# EAGLE schematic AtoVproject 16n V1.1 (EAGLE 9.3.2)

## Sheet 1 of 2: Faders / Jacks / Digital
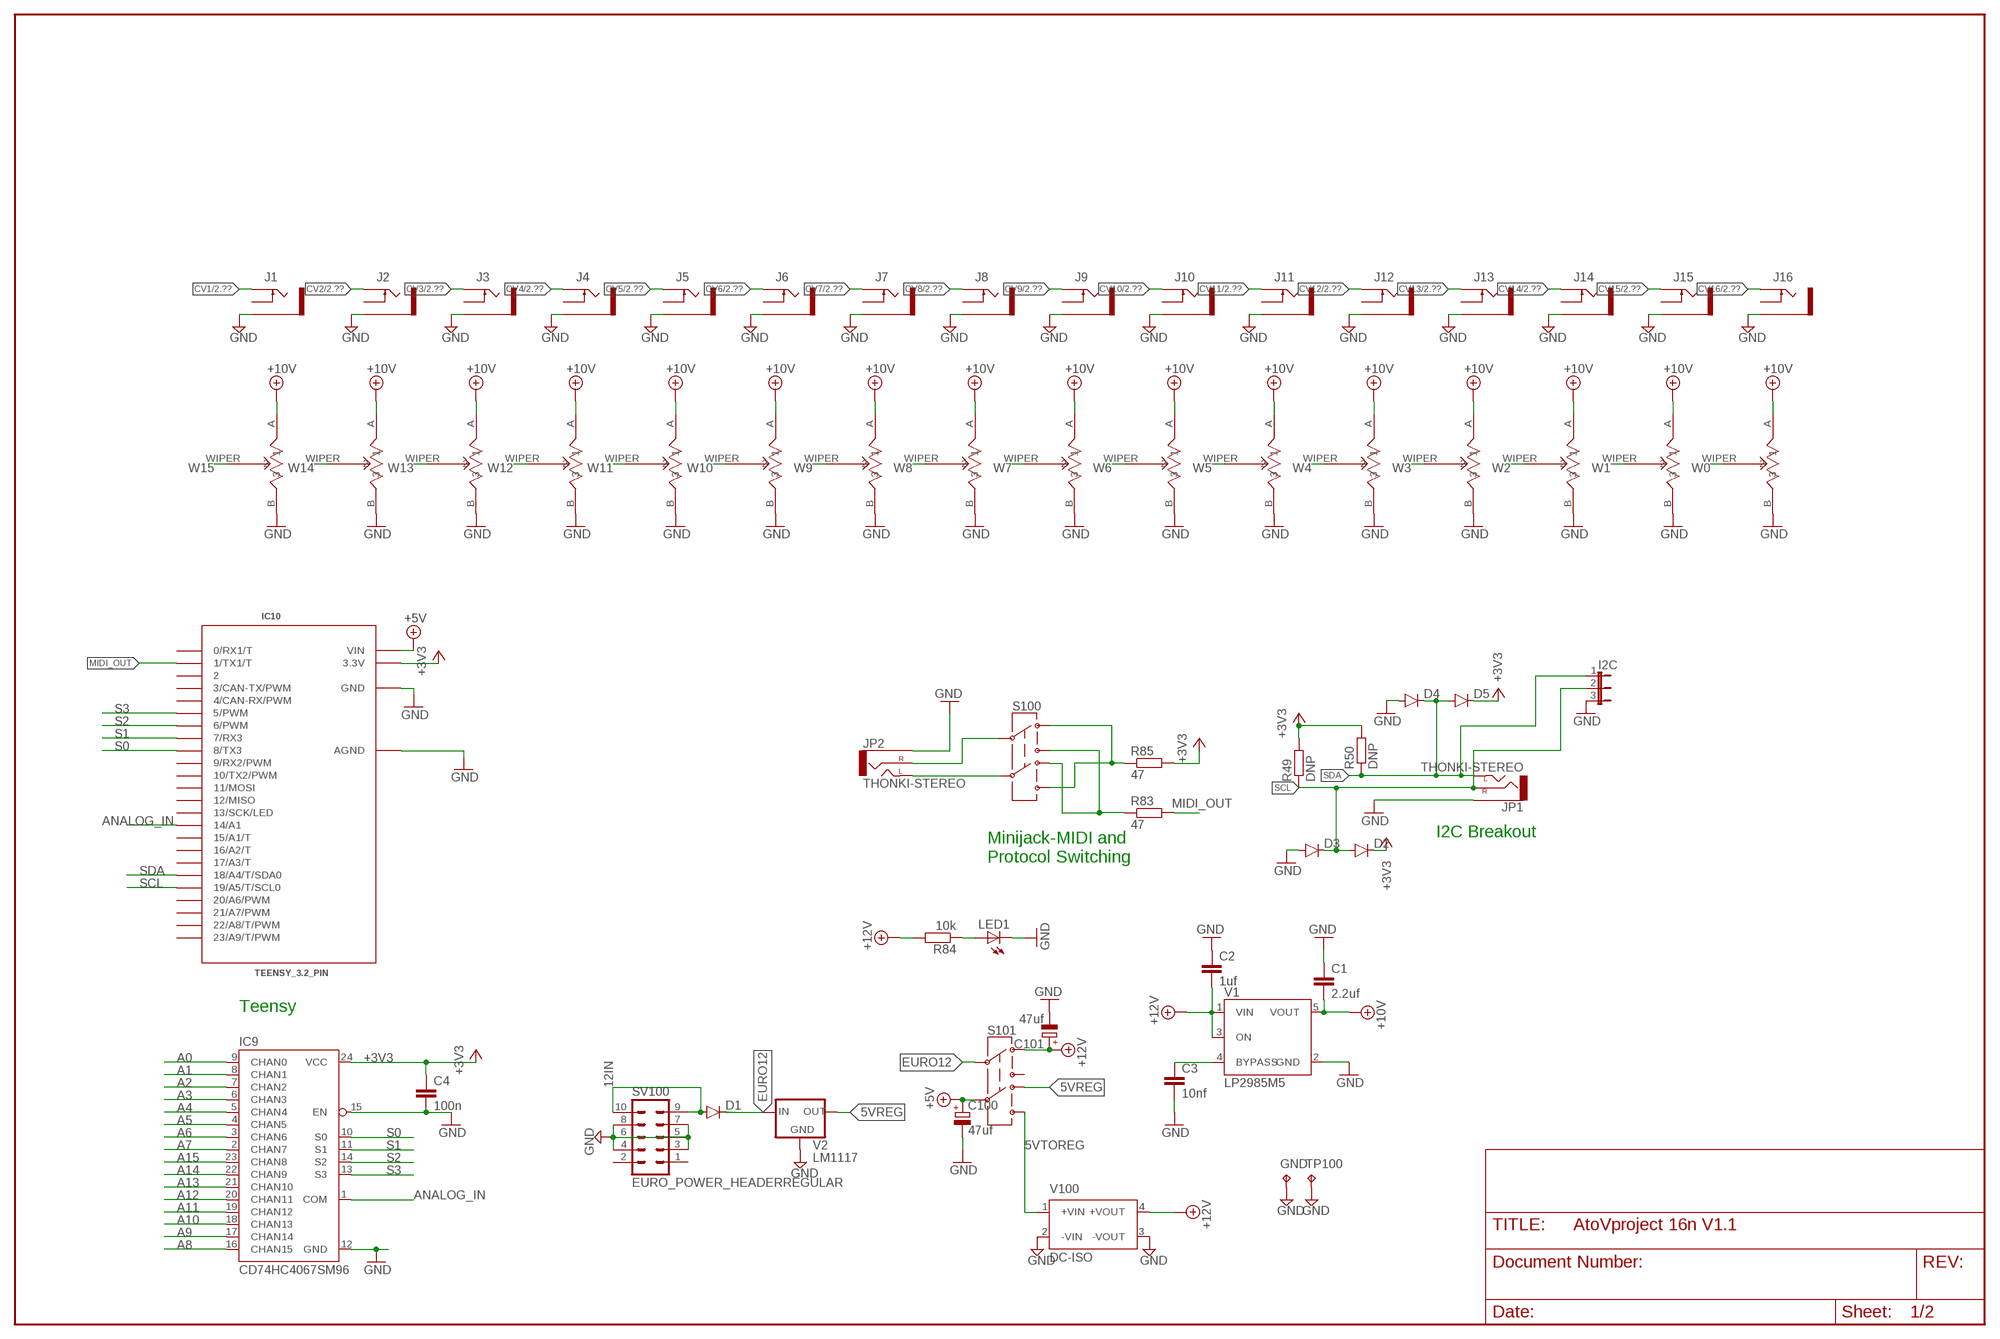
[diagram p0: schematic, sheet 1]

### Parts
C1  2.2uf  C-EUC0805  [C0805]
C2  1uf  C-EUC0805  [C0805]
C3  10nf  C-EUC0805  [C0805]
C4  100n  C-EUC0805  [C0805]
C100  47uf  CPOL-EUE2.5-6  [E2,5-6]
C101  47uf  CPOL-EUE2.5-6  [E2,5-6]
D1  DIODE-SOD123  [SOD123]
D2  DIODESOD123  [SOD-123]
D3  DIODESOD123  [SOD-123]
D4  DIODESOD123  [SOD-123]
D5  DIODESOD123  [SOD-123]
GND  TPPAD1-17  [P1-17]
I2C  JP2E  [JP2]
IC9  CD74HC4067SM96  744067SO24  [SOIC127P1030X265-24]
IC10  TEENSY_3.2_PIN  [TEENSY_3_AND_LC_SERIES_BOARDS_V1.4_TEENSY_3.0-3.2&LC_DIL]
J1  THONKICONN  [WQP-PJ301M-12JACK-BANANA]
J2  THONKICONN  [WQP-PJ301M-12JACK-BANANA]
J3  THONKICONN  [WQP-PJ301M-12JACK-BANANA]
J4  THONKICONN  [WQP-PJ301M-12JACK-BANANA]
J5  THONKICONN  [WQP-PJ301M-12JACK-BANANA]
J6  THONKICONN  [WQP-PJ301M-12JACK-BANANA]
J7  THONKICONN  [WQP-PJ301M-12JACK-BANANA]
J8  THONKICONN  [WQP-PJ301M-12JACK-BANANA]
J9  THONKICONN  [WQP-PJ301M-12JACK-BANANA]
J10  THONKICONN  [WQP-PJ301M-12JACK-BANANA]
J11  THONKICONN  [WQP-PJ301M-12JACK-BANANA]
J12  THONKICONN  [WQP-PJ301M-12JACK-BANANA]
J13  THONKICONN  [WQP-PJ301M-12JACK-BANANA]
J14  THONKICONN  [WQP-PJ301M-12JACK-BANANA]
J15  THONKICONN  [WQP-PJ301M-12JACK-BANANA]
J16  THONKICONN  [WQP-PJ301M-12JACK-BANANA]
JP1  THONKI-STEREO  [WQP-PJ366ST_JACK]
JP2  THONKI-STEREO  [WQP-PJ366ST_JACK]
LED1  LED  [LED3MM]
R49  DNP  R-EU_R0805  [R0805]
R50  DNP  R-EU_R0805  [R0805]
R83  47  R-EU_R0805  [R0805]
R84  10k  R-EU_R0805  [R0805]
R85  47  R-EU_R0805  [R0805]
S100  SWITCH-DPDTEG2211  [EG2211]
S101  SWITCH-DPDTEG2211  [EG2211]
SV100  EURO_POWER_HEADERREGULAR  [EURO_POWER_HEADER]
TP100  TPPAD1-17  [P1-17]
U$1  SLIDERSBOURNS-60MM  [SLIDEPOT-75]
U$2  SLIDERSBOURNS-60MM  [SLIDEPOT-75]
U$3  SLIDERSBOURNS-60MM  [SLIDEPOT-75]
U$4  SLIDERSBOURNS-60MM  [SLIDEPOT-75]
U$5  SLIDERSBOURNS-60MM  [SLIDEPOT-75]
U$6  SLIDERSBOURNS-60MM  [SLIDEPOT-75]
U$7  SLIDERSBOURNS-60MM  [SLIDEPOT-75]
U$8  SLIDERSBOURNS-60MM  [SLIDEPOT-75]
U$9  SLIDERSBOURNS-60MM  [SLIDEPOT-75]
U$10  SLIDERSBOURNS-60MM  [SLIDEPOT-75]
U$11  SLIDERSBOURNS-60MM  [SLIDEPOT-75]
U$12  SLIDERSBOURNS-60MM  [SLIDEPOT-75]
U$13  SLIDERSBOURNS-60MM  [SLIDEPOT-75]
U$14  SLIDERSBOURNS-60MM  [SLIDEPOT-75]
U$15  SLIDERSBOURNS-60MM  [SLIDEPOT-75]
U$16  SLIDERSBOURNS-60MM  [SLIDEPOT-75]
V1  LP2985M5  [SOT23-5]
V2  LM1117  [SOT223]
V100  DC-ISO  [TMA]

### Nets
5VREG: S101.P2-TA V2.OUT V2.TAB(OUT)
5VTOREG: S101.P2-TB V100.1(+VIN)
12IN: D1.A SV100.9 SV100.10
+3V3: C4.1 D2.C D5.C IC9.24(VCC) IC10.3.3V R49.2 R50.2 R85.2
+5V: C100.+ IC10.VIN S101.P2 ; also sheet 2
+10V: C1.2 U$1.A U$2.A U$3.A U$4.A U$5.A U$6.A U$7.A U$8.A U$9.A U$10.A U$11.A U$12.A U$13.A U$14.A U$15.A U$16.A V1.5(VOUT)
+12V: C2.2 C101.+ R84.2 S101.P1-TA V1.1(VIN) V1.3(ON) V100.4(+VOUT) ; also sheet 2
A0: IC9.9(CHAN0) ; also sheet 2
A1: IC9.8(CHAN1) ; also sheet 2
A2: IC9.7(CHAN2) ; also sheet 2
A3: IC9.6(CHAN3) ; also sheet 2
A4: IC9.5(CHAN4) ; also sheet 2
A5: IC9.4(CHAN5) ; also sheet 2
A6: IC9.3(CHAN6) ; also sheet 2
A7: IC9.2(CHAN7) ; also sheet 2
A8: IC9.16(CHAN15) ; also sheet 2
A9: IC9.17(CHAN14) ; also sheet 2
A10: IC9.18(CHAN13) ; also sheet 2
A11: IC9.19(CHAN12) ; also sheet 2
A12: IC9.20(CHAN11) ; also sheet 2
A13: IC9.21(CHAN10) ; also sheet 2
A14: IC9.22(CHAN9) ; also sheet 2
A15: IC9.23(CHAN8) ; also sheet 2
ANALOG_IN: IC9.1(COM) IC10.14/A0(14/A1)
CV1: J1.P$1_TIP(TIP) ; also sheet 2
CV2: J2.P$1_TIP(TIP) ; also sheet 2
CV3: J3.P$1_TIP(TIP) ; also sheet 2
CV4: J4.P$1_TIP(TIP) ; also sheet 2
CV5: J5.P$1_TIP(TIP) ; also sheet 2
CV6: J6.P$1_TIP(TIP) ; also sheet 2
CV7: J7.P$1_TIP(TIP) ; also sheet 2
CV8: J8.P$1_TIP(TIP) ; also sheet 2
CV9: J9.P$1_TIP(TIP) ; also sheet 2
CV10: J10.P$1_TIP(TIP) ; also sheet 2
CV11: J11.P$1_TIP(TIP) ; also sheet 2
CV12: J12.P$1_TIP(TIP) ; also sheet 2
CV13: J13.P$1_TIP(TIP) ; also sheet 2
CV14: J14.P$1_TIP(TIP) ; also sheet 2
CV15: J15.P$1_TIP(TIP) ; also sheet 2
CV16: J16.P$1_TIP(TIP) ; also sheet 2
EURO12: D1.C S101.P1 V2.IN
GND: C1.1 C2.1 C3.2 C4.2 C100.- C101.- D3.A D4.A GND.TP I2C.3 IC9.12(GND) IC9.15(EN) IC10.AGND IC10.GND J1.P$3_SLEEVE(SLEEVE) J2.P$3_SLEEVE(SLEEVE) J3.P$3_SLEEVE(SLEEVE) J4.P$3_SLEEVE(SLEEVE) J5.P$3_SLEEVE(SLEEVE) J6.P$3_SLEEVE(SLEEVE) J7.P$3_SLEEVE(SLEEVE) J8.P$3_SLEEVE(SLEEVE) J9.P$3_SLEEVE(SLEEVE) J10.P$3_SLEEVE(SLEEVE) J11.P$3_SLEEVE(SLEEVE) J12.P$3_SLEEVE(SLEEVE) J13.P$3_SLEEVE(SLEEVE) J14.P$3_SLEEVE(SLEEVE) J15.P$3_SLEEVE(SLEEVE) J16.P$3_SLEEVE(SLEEVE) JP1.P$3_SLEEVE(SLEEVE) JP2.P$3_SLEEVE(SLEEVE) LED1.K(C) SV100.3 SV100.4 SV100.5 SV100.6 SV100.7 SV100.8 TP100.TP U$1.B U$2.B U$3.B U$4.B U$5.B U$6.B U$7.B U$8.B U$9.B U$10.B U$11.B U$12.B U$13.B U$14.B U$15.B U$16.B V1.2(GND) V2.GND V100.2(-VIN) V100.3(-VOUT) ; also sheet 2
MIDI_OUT: IC10.1(1/TX1/T) R83.2
N$1: JP2.P$1_TIP(LEFT) S100.P2
N$2: JP2.P$2_SWITCH(RIGHT) S100.P1
N$3: R83.1 S100.P1-TB S100.P2-TA
N$4: R85.1 S100.P1-TA S100.P2-TB
N$28: LED1.A R84.1
N$54: C3.1 V1.4(BYPASS)
S0: IC9.10(S0) IC10.8(8/TX3)
S1: IC9.11(S1) IC10.7(7/RX3)
S2: IC9.14(S2) IC10.6(6/PWM)
S3: IC9.13(S3) IC10.5(5/PWM)
SCL: D2.A D3.C I2C.2 IC10.19/A5(19/A5/T/SCL0) JP1.P$2_SWITCH(RIGHT) R49.1
SDA: D4.C D5.A I2C.1 IC10.18/A4(18/A4/T/SDA0) JP1.P$1_TIP(LEFT) R50.1
W0: U$1.WIPER ; also sheet 2
W1: U$2.WIPER ; also sheet 2
W2: U$3.WIPER ; also sheet 2
W3: U$4.WIPER ; also sheet 2
W4: U$5.WIPER ; also sheet 2
W5: U$6.WIPER ; also sheet 2
W6: U$7.WIPER ; also sheet 2
W7: U$8.WIPER ; also sheet 2
W8: U$9.WIPER ; also sheet 2
W9: U$10.WIPER ; also sheet 2
W10: U$11.WIPER ; also sheet 2
W11: U$12.WIPER ; also sheet 2
W12: U$13.WIPER ; also sheet 2
W13: U$14.WIPER ; also sheet 2
W14: U$15.WIPER ; also sheet 2
W15: U$16.WIPER ; also sheet 2
Unconnected: IC10.0(0/RX1/T) IC10.2 IC10.3(3/CAN-TX/PWM) IC10.4(4/CAN-RX/PWM) IC10.9(9/RX2/PWM) IC10.10(10/TX2/PWM) IC10.11(11/MOSI) IC10.12(12/MISO) IC10.13(13/SCK/LED) IC10.15/A1(15/A1/T) IC10.16/A2(16/A2/T) IC10.17/A3(17/A3/T) IC10.20/A6(20/A6/PWM) IC10.21/A7(21/A7/PWM) IC10.22/A8(22/A8/T/PWM) IC10.23/A9(23/A9/T/PWM) J1.P$2_SWITCH(SWITCH) J2.P$2_SWITCH(SWITCH) J3.P$2_SWITCH(SWITCH) J4.P$2_SWITCH(SWITCH) J5.P$2_SWITCH(SWITCH) J6.P$2_SWITCH(SWITCH) J7.P$2_SWITCH(SWITCH) J8.P$2_SWITCH(SWITCH) J9.P$2_SWITCH(SWITCH) J10.P$2_SWITCH(SWITCH) J11.P$2_SWITCH(SWITCH) J12.P$2_SWITCH(SWITCH) J13.P$2_SWITCH(SWITCH) J14.P$2_SWITCH(SWITCH) J15.P$2_SWITCH(SWITCH) J16.P$2_SWITCH(SWITCH) S101.P1-TB SV100.1 SV100.2

### Notes on the sheet
- I2C Breakout
- Minijack-MIDI and 
  Protocol Switching
- Teensy

## Sheet 2 of 2: Buffers / OpAmp power
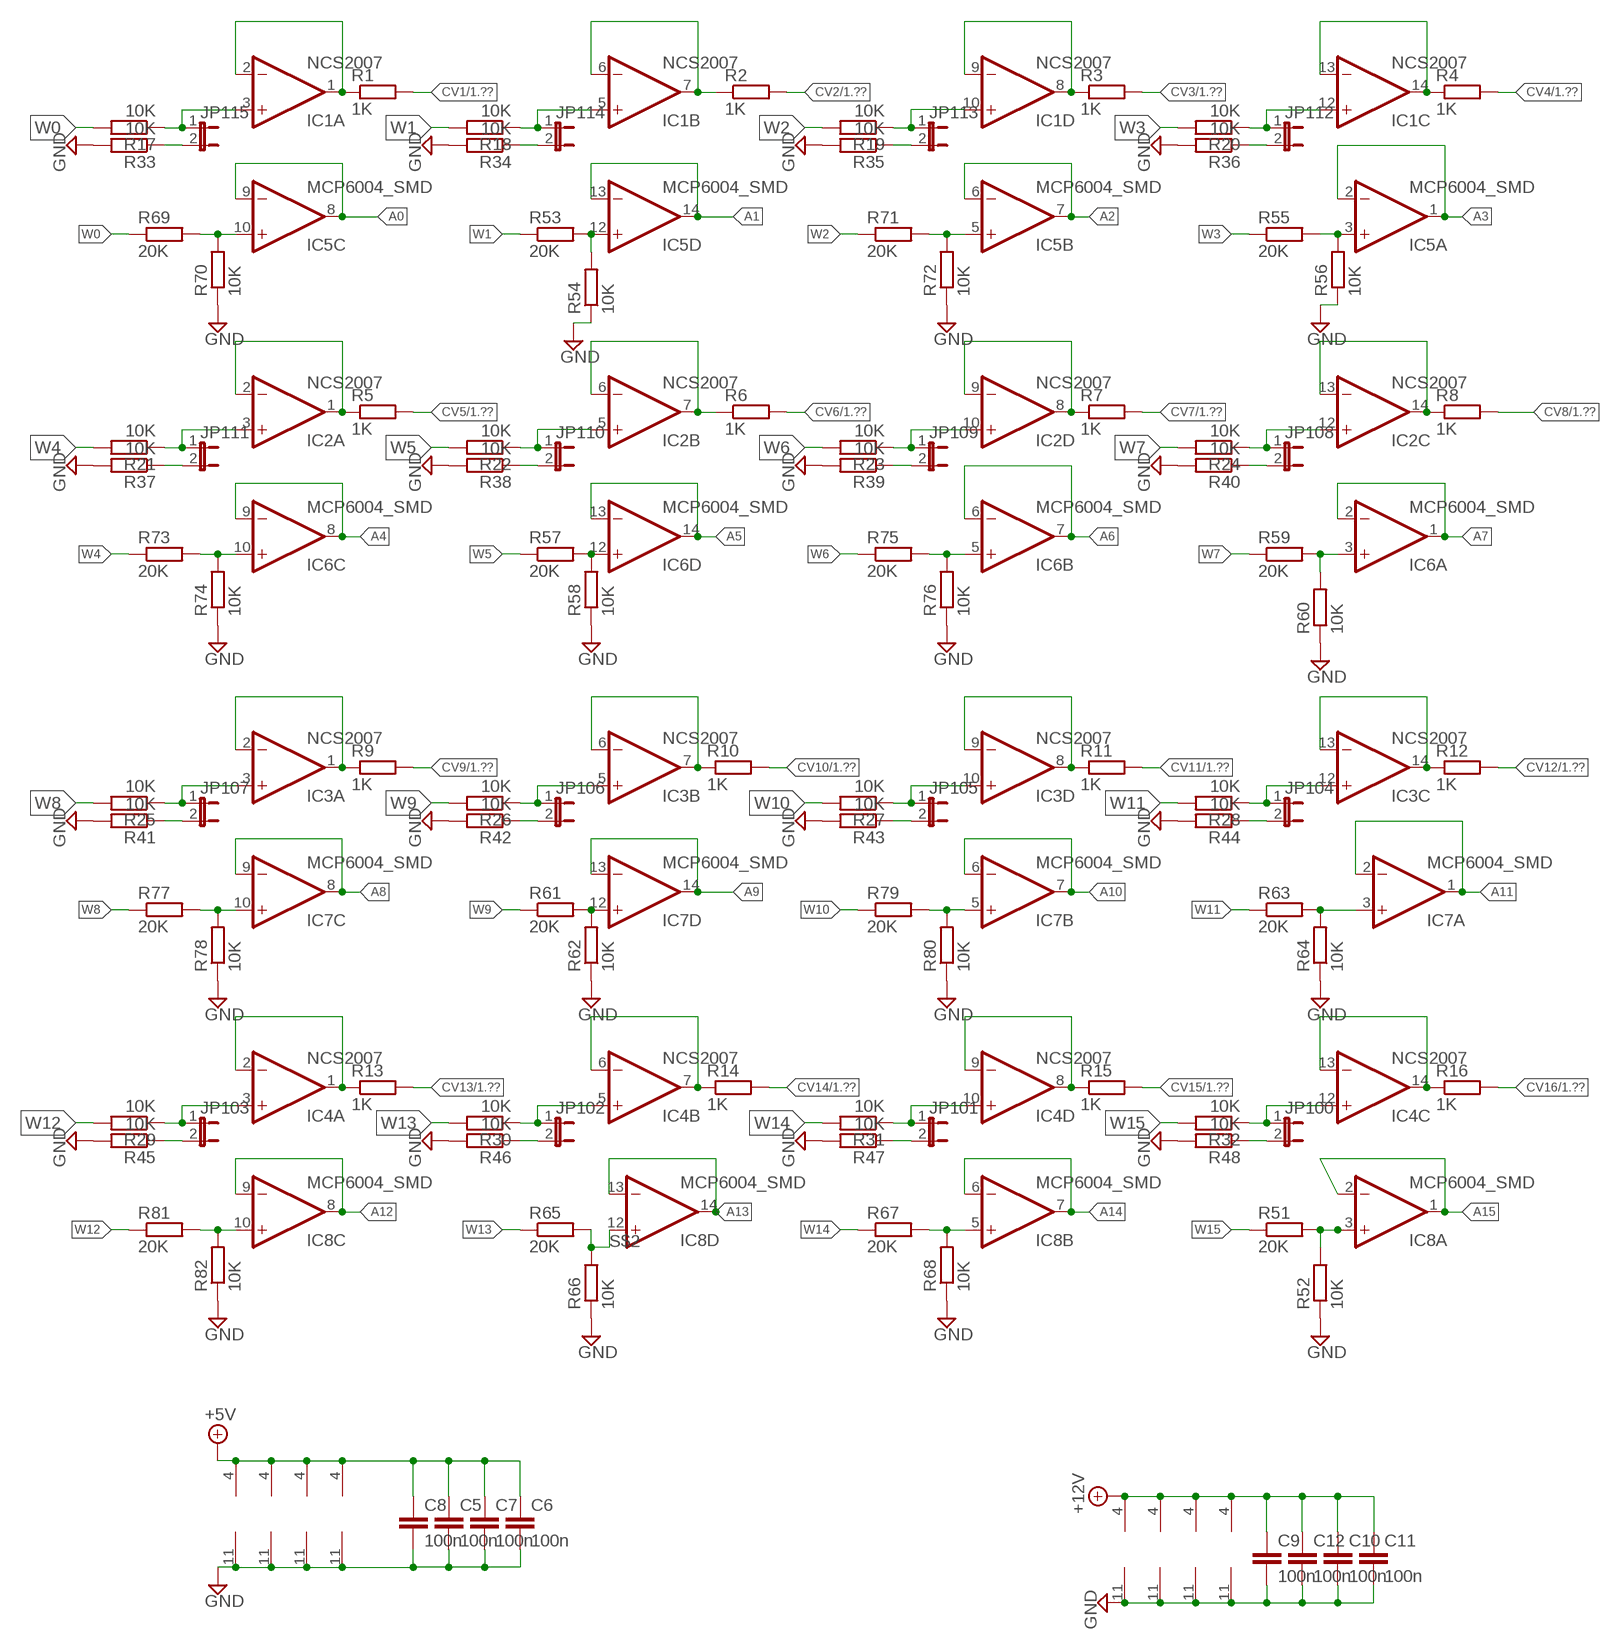
[diagram p1: schematic, sheet 2]

### Parts
C5  100n  C-EUC0805  [C0805]
C6  100n  C-EUC0805  [C0805]
C7  100n  C-EUC0805  [C0805]
C8  100n  C-EUC0805  [C0805]
C9  100n  C-EUC0805  [C0805]
C10  100n  C-EUC0805  [C0805]
C11  100n  C-EUC0805  [C0805]
C12  100n  C-EUC0805  [C0805]
IC1  NCS2007  TL074  [SO14]
IC2  NCS2007  TL074  [SO14]
IC3  NCS2007  TL074  [SO14]
IC4  NCS2007  TL074  [SO14]
IC5  MCP6004_SMD  [SO14]
IC6  MCP6004_SMD  [SO14]
IC7  MCP6004_SMD  [SO14]
IC8  MCP6004_SMD  [SO14]
JP100  JP1E3D  [1X02]
JP101  JP1E3D  [1X02]
JP102  JP1E3D  [1X02]
JP103  JP1E3D  [1X02]
JP104  JP1E3D  [1X02]
JP105  JP1E3D  [1X02]
JP106  JP1E3D  [1X02]
JP107  JP1E3D  [1X02]
JP108  JP1E3D  [1X02]
JP109  JP1E3D  [1X02]
JP110  JP1E3D  [1X02]
JP111  JP1E3D  [1X02]
JP112  JP1E3D  [1X02]
JP113  JP1E3D  [1X02]
JP114  JP1E3D  [1X02]
JP115  JP1E3D  [1X02]
R1  1K  R-EU_R0805  [R0805]
R2  1K  R-EU_R0805  [R0805]
R3  1K  R-EU_R0805  [R0805]
R4  1K  R-EU_R0805  [R0805]
R5  1K  R-EU_R0805  [R0805]
R6  1K  R-EU_R0805  [R0805]
R7  1K  R-EU_R0805  [R0805]
R8  1K  R-EU_R0805  [R0805]
R9  1K  R-EU_R0805  [R0805]
R10  1K  R-EU_R0805  [R0805]
R11  1K  R-EU_R0805  [R0805]
R12  1K  R-EU_R0805  [R0805]
R13  1K  R-EU_R0805  [R0805]
R14  1K  R-EU_R0805  [R0805]
R15  1K  R-EU_R0805  [R0805]
R16  1K  R-EU_R0805  [R0805]
R17  10K  R-EU_R0805  [R0805]
R18  10K  R-EU_R0805  [R0805]
R19  10K  R-EU_R0805  [R0805]
R20  10K  R-EU_R0805  [R0805]
R21  10K  R-EU_R0805  [R0805]
R22  10K  R-EU_R0805  [R0805]
R23  10K  R-EU_R0805  [R0805]
R24  10K  R-EU_R0805  [R0805]
R25  10K  R-EU_R0805  [R0805]
R26  10K  R-EU_R0805  [R0805]
R27  10K  R-EU_R0805  [R0805]
R28  10K  R-EU_R0805  [R0805]
R29  10K  R-EU_R0805  [R0805]
R30  10K  R-EU_R0805  [R0805]
R31  10K  R-EU_R0805  [R0805]
R32  10K  R-EU_R0805  [R0805]
R33  10K  R-EU_R0805  [R0805]
R34  10K  R-EU_R0805  [R0805]
R35  10K  R-EU_R0805  [R0805]
R36  10K  R-EU_R0805  [R0805]
R37  10K  R-EU_R0805  [R0805]
R38  10K  R-EU_R0805  [R0805]
R39  10K  R-EU_R0805  [R0805]
R40  10K  R-EU_R0805  [R0805]
R41  10K  R-EU_R0805  [R0805]
R42  10K  R-EU_R0805  [R0805]
R43  10K  R-EU_R0805  [R0805]
R44  10K  R-EU_R0805  [R0805]
R45  10K  R-EU_R0805  [R0805]
R46  10K  R-EU_R0805  [R0805]
R47  10K  R-EU_R0805  [R0805]
R48  10K  R-EU_R0805  [R0805]
R51  20K  R-EU_R0805  [R0805]
R52  10K  R-EU_R0805  [R0805]
R53  20K  R-EU_R0805  [R0805]
R54  10K  R-EU_R0805  [R0805]
R55  20K  R-EU_R0805  [R0805]
R56  10K  R-EU_R0805  [R0805]
R57  20K  R-EU_R0805  [R0805]
R58  10K  R-EU_R0805  [R0805]
R59  20K  R-EU_R0805  [R0805]
R60  10K  R-EU_R0805  [R0805]
R61  20K  R-EU_R0805  [R0805]
R62  10K  R-EU_R0805  [R0805]
R63  20K  R-EU_R0805  [R0805]
R64  10K  R-EU_R0805  [R0805]
R65  20K  R-EU_R0805  [R0805]
R66  10K  R-EU_R0805  [R0805]
R67  20K  R-EU_R0805  [R0805]
R68  10K  R-EU_R0805  [R0805]
R69  20K  R-EU_R0805  [R0805]
R70  10K  R-EU_R0805  [R0805]
R71  20K  R-EU_R0805  [R0805]
R72  10K  R-EU_R0805  [R0805]
R73  20K  R-EU_R0805  [R0805]
R74  10K  R-EU_R0805  [R0805]
R75  20K  R-EU_R0805  [R0805]
R76  10K  R-EU_R0805  [R0805]
R77  20K  R-EU_R0805  [R0805]
R78  10K  R-EU_R0805  [R0805]
R79  20K  R-EU_R0805  [R0805]
R80  10K  R-EU_R0805  [R0805]
R81  20K  R-EU_R0805  [R0805]
R82  10K  R-EU_R0805  [R0805]

### Nets
+5V: C5.1 C6.1 C7.1 C8.1 IC5.4(P:V+) IC6.4(P:V+) IC7.4(P:V+) IC8.4(P:V+) ; also sheet 1
+12V: C9.1 C10.1 C11.1 C12.1 IC1.4(V+) IC2.4(V+) IC3.4(V+) IC4.4(V+) ; also sheet 1
A0: IC5.8(C:OUT) IC5.9(C:-IN) ; also sheet 1
A1: IC5.13(D:-IN) IC5.14(D:OUT) ; also sheet 1
A2: IC5.6(B:-IN) IC5.7(B:OUT) ; also sheet 1
A3: IC5.1(A:OUT) IC5.2(A:-IN) ; also sheet 1
A4: IC6.8(C:OUT) IC6.9(C:-IN) ; also sheet 1
A5: IC6.13(D:-IN) IC6.14(D:OUT) ; also sheet 1
A6: IC6.6(B:-IN) IC6.7(B:OUT) ; also sheet 1
A7: IC6.1(A:OUT) IC6.2(A:-IN) ; also sheet 1
A8: IC7.8(C:OUT) IC7.9(C:-IN) ; also sheet 1
A9: IC7.13(D:-IN) IC7.14(D:OUT) ; also sheet 1
A10: IC7.6(B:-IN) IC7.7(B:OUT) ; also sheet 1
A11: IC7.1(A:OUT) IC7.2(A:-IN) ; also sheet 1
A12: IC8.8(C:OUT) IC8.9(C:-IN) ; also sheet 1
A13: IC8.13(D:-IN) IC8.14(D:OUT) ; also sheet 1
A14: IC8.6(B:-IN) IC8.7(B:OUT) ; also sheet 1
A15: IC8.1(A:OUT) IC8.2(A:-IN) ; also sheet 1
CV1: R1.2 ; also sheet 1
CV2: R2.2 ; also sheet 1
CV3: R3.2 ; also sheet 1
CV4: R4.2 ; also sheet 1
CV5: R5.2 ; also sheet 1
CV6: R6.2 ; also sheet 1
CV7: R7.2 ; also sheet 1
CV8: R8.2 ; also sheet 1
CV9: R9.2 ; also sheet 1
CV10: R10.2 ; also sheet 1
CV11: R11.2 ; also sheet 1
CV12: R12.2 ; also sheet 1
CV13: R13.2 ; also sheet 1
CV14: R14.2 ; also sheet 1
CV15: R15.2 ; also sheet 1
CV16: R16.2 ; also sheet 1
GND: C5.2 C6.2 C7.2 C8.2 C9.2 C10.2 C11.2 C12.2 IC1.11(V-) IC2.11(V-) IC3.11(V-) IC4.11(V-) IC5.11(P:V-) IC6.11(P:V-) IC7.11(P:V-) IC8.11(P:V-) R33.2 R34.2 R35.2 R36.2 R37.2 R38.2 R39.2 R40.2 R41.2 R42.2 R43.2 R44.2 R45.2 R46.2 R47.2 R48.2 R52.1 R54.1 R56.1 R58.1 R60.1 R62.1 R64.1 R66.1 R68.1 R70.1 R72.1 R74.1 R76.1 R78.1 R80.1 R82.1 ; also sheet 1
N$5: IC1.3(A:+IN) JP115.1 R17.1
N$6: IC5.5(B:+IN) R71.2 R72.2
N$7: IC5.3(A:+IN) R55.2 R56.2
N$8: JP115.2 R33.1
N$9: IC5.10(C:+IN) R69.2 R70.2
N$10: IC5.12(D:+IN) R53.2 R54.2
N$11: IC1.5(B:+IN) JP114.1 R18.1
N$12: IC6.10(C:+IN) R73.2 R74.2
N$13: IC6.12(D:+IN) R57.2 R58.2
N$14: JP114.2 R34.1
N$15: IC6.5(B:+IN) R75.2 R76.2
N$16: IC6.3(A:+IN) R59.2 R60.2
N$17: IC1.10(D:+IN) JP113.1 R19.1
N$18: IC7.10(C:+IN) R77.2 R78.2
N$19: IC7.12(D:+IN) R61.2 R62.2
N$20: JP113.2 R35.1
N$21: IC7.5(B:+IN) R79.2 R80.2
N$22: IC7.3(A:+IN) R63.2 R64.2
N$23: IC1.12(C:+IN) JP112.1 R20.1
N$24: IC8.3(A:+IN) R51.2 R52.2
N$25: IC8.10(C:+IN) R81.2 R82.2
N$26: JP112.2 R36.1
N$27: IC8.5(B:+IN) R67.2 R68.2
N$29: IC2.3(A:+IN) JP111.1 R21.1
N$30: JP111.2 R37.1
N$31: IC2.5(B:+IN) JP110.1 R22.1
N$32: JP110.2 R38.1
N$33: IC2.10(D:+IN) JP109.1 R23.1
N$34: JP109.2 R39.1
N$35: IC2.12(C:+IN) JP108.1 R24.1
N$36: JP108.2 R40.1
N$37: IC3.3(A:+IN) JP107.1 R25.1
N$38: JP107.2 R41.1
N$39: IC3.5(B:+IN) JP106.1 R26.1
N$40: JP106.2 R42.1
N$41: IC3.10(D:+IN) JP105.1 R27.1
N$42: JP105.2 R43.1
N$43: IC3.12(C:+IN) JP104.1 R28.1
N$44: JP104.2 R44.1
N$45: IC4.3(A:+IN) JP103.1 R29.1
N$46: JP103.2 R45.1
N$47: IC4.5(B:+IN) JP102.1 R30.1
N$48: JP102.2 R46.1
N$49: IC4.10(D:+IN) JP101.1 R31.1
N$50: JP101.2 R47.1
N$51: IC4.12(C:+IN) JP100.1 R32.1
N$52: JP100.2 R48.1
N$55: IC4.8(D:OUT) IC4.9(D:-IN) R15.1
N$300: IC1.1(A:OUT) IC1.2(A:-IN) R1.1
N$301: IC1.6(B:-IN) IC1.7(B:OUT) R2.1
N$302: IC1.8(D:OUT) IC1.9(D:-IN) R3.1
N$303: IC1.13(C:-IN) IC1.14(C:OUT) R4.1
N$304: IC2.1(A:OUT) IC2.2(A:-IN) R5.1
N$305: IC2.6(B:-IN) IC2.7(B:OUT) R6.1
N$306: IC2.8(D:OUT) IC2.9(D:-IN) R7.1
N$307: IC2.13(C:-IN) IC2.14(C:OUT) R8.1
N$308: IC3.1(A:OUT) IC3.2(A:-IN) R9.1
N$309: IC3.6(B:-IN) IC3.7(B:OUT) R10.1
N$310: IC3.8(D:OUT) IC3.9(D:-IN) R11.1
N$311: IC3.13(C:-IN) IC3.14(C:OUT) R12.1
N$312: IC4.1(A:OUT) IC4.2(A:-IN) R13.1
N$313: IC4.6(B:-IN) IC4.7(B:OUT) R14.1
N$315: IC4.13(C:-IN) IC4.14(C:OUT) R16.1
S$2: IC8.12(D:+IN) R65.2 R66.2
W0: R17.2 R69.1 ; also sheet 1
W1: R18.2 R53.1 ; also sheet 1
W2: R19.2 R71.1 ; also sheet 1
W3: R20.2 R55.1 ; also sheet 1
W4: R21.2 R73.1 ; also sheet 1
W5: R22.2 R57.1 ; also sheet 1
W6: R23.2 R75.1 ; also sheet 1
W7: R24.2 R59.1 ; also sheet 1
W8: R25.2 R77.1 ; also sheet 1
W9: R26.2 R61.1 ; also sheet 1
W10: R27.2 R79.1 ; also sheet 1
W11: R28.2 R63.1 ; also sheet 1
W12: R29.2 R81.1 ; also sheet 1
W13: R30.2 R65.1 ; also sheet 1
W14: R31.2 R67.1 ; also sheet 1
W15: R32.2 R51.1 ; also sheet 1

## Library data of the parts
C1-C12 = rcl:C-EU: CAPACITOR, European symbol; SPICEPREFIX: C
C100 C101 = resistor:CPOL-EU: POLARIZED CAPACITOR, European symbol
D1 = diode:DIODE-: DIODE
D2-D5 = foxfield:DIODE
GND TP100 = testpad:TP: Test pad
I2C = jumper:JP2E: JUMPER
IC1-IC4 = AtoVproject:TL074
IC5-IC8 = MusicThingModular:MCP6004: Generic Quad Op Amp
IC9 = foxfield:74*4067: 16-channel analog MUX Datasheet <http://www.sparkfun.com/datasheets/IC/cd74hc4067.pdf> SparkFun Products MP3 Trigger <https://www.sparkfun.com/products/13720> (WIG-13720) SparkFun Analog/Digital MUX Breakout - CD74HC4067 <https://www.sparkfun.com/products/9056> (BOB-09056)
IC10 = AtoVproject:TEENSY_3.2_PIN: Teensy 3.1 or 3.2 in a DIL Layout.
J1-J16 = AtoVproject:THONKICONN: 3.5mm socket for Eurorack modular synths
JP1 JP2 = AtoVproject:THONKI-STEREO: 3.5mm socket for Eurorack modular synths
JP100-JP115 = AtoVproject:JP1E: JUMPER
LED1 = AtoVproject:LED
R1-R85 = rcl:R-EU_: RESISTOR, European symbol
S100 S101 = SparkFun-Electromechanical:SWITCH-DPDT: DPDT Version of the COM-00597
SV100 = AtoVproject:EURO_POWER_HEADER: Power Header 10 pin power header for Eurorack Power Supplies Variants with fatter pads for easier soldering, and the LOCK variant which has 5mil offset pins to hold the component in place before soldering
U$1-U$16 = AtoVproject:SLIDERS
V1 = v-reg-3:LP2985: National Semiconductor <http://www.national.com> Micropower Linear Regulator 150mA regulated output, Vin 16V max., ultra-low dropout of 300mV @ 150mA, 1µA standby current, low noise
V2 = AtoVproject:LM1117
V100 = AtoVproject:DC-ISO: DC/DC Converter TME Series 1 Watt Source: www.tracopower.com .. tme.pdf